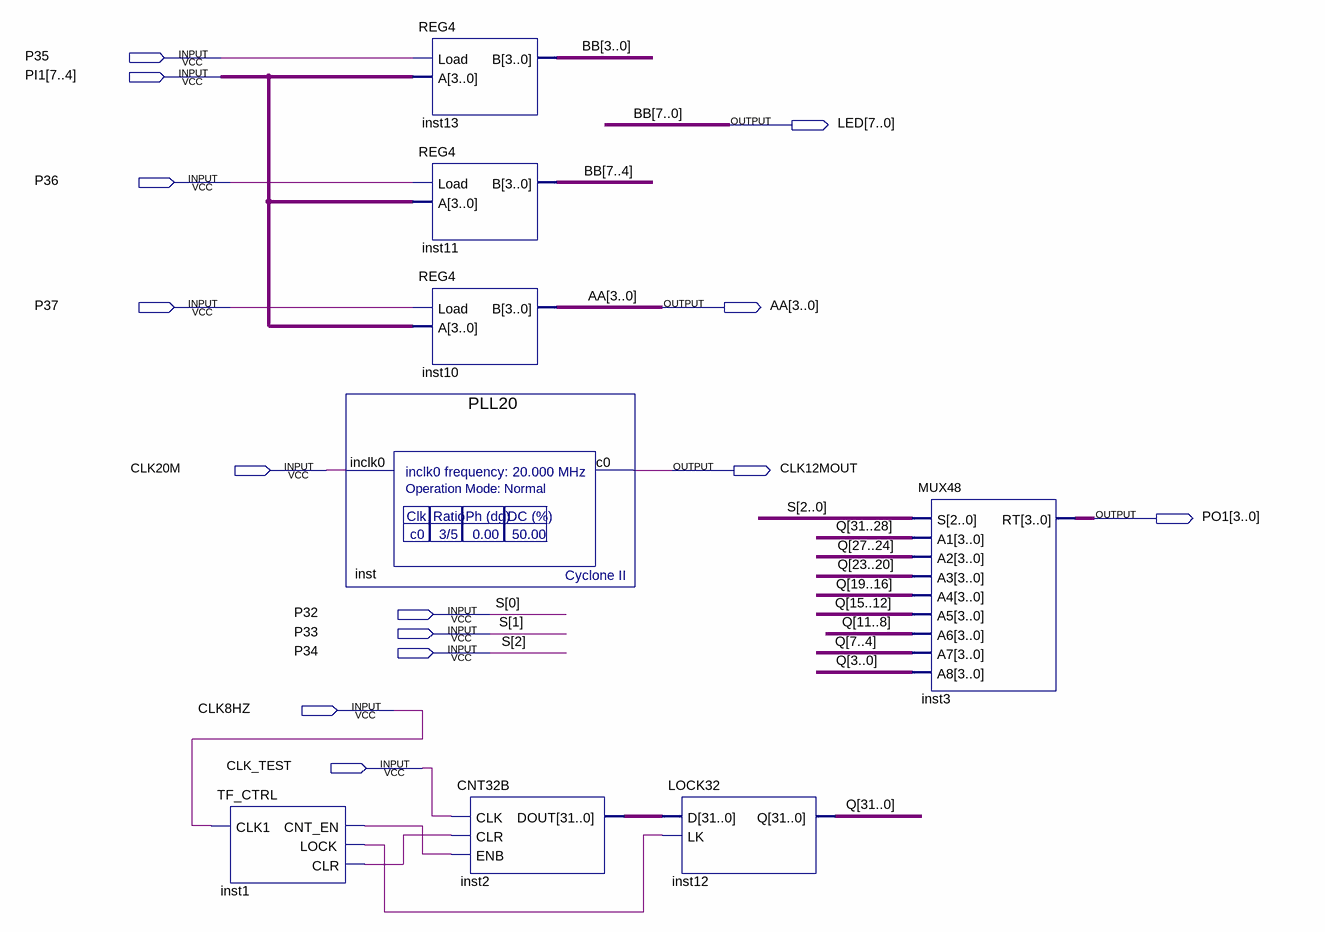
[diagram p0: schematic sheet]
// Quartus schematic CNT6B.bdf as structural Verilog: 8 symbols, 14 pins
module CNT6B (
  input  P35,
  input  [7:4] PI1,
  input  P36,
  input  P37,
  input  CLK20M,
  input  P32,
  input  P33,
  input  P34,
  input  CLK8HZ,
  input  CLK_TEST,
  output [7:0] LED,
  output [3:0] AA,
  output CLK12MOUT,
  output [3:0] PO1
);

  wire inst1_clr, inst1_cnt_en, inst1_lock;
  wire [31:0] inst2_dout, Q;

  TF_CTRL inst1 (.CLK1(CLK8HZ), .CNT_EN(inst1_cnt_en), .LOCK(inst1_lock), .CLR(inst1_clr));
  PLL20 inst (.inclk0(CLK20M), .c0(CLK12MOUT));
  REG4 inst13 (.Load(P35), .A(PI1), .B(LED[3:0]));
  REG4 inst11 (.Load(P36), .A(PI1), .B(LED[7:4]));
  REG4 inst10 (.Load(P37), .A(PI1), .B(AA));
  CNT32B inst2 (.CLK(CLK_TEST), .CLR(inst1_clr), .ENB(inst1_cnt_en), .DOUT(inst2_dout));
  LOCK32 inst12 (.D(inst2_dout), .LK(inst1_lock), .Q(Q));
  MUX48 inst3 (
    .S({P34, P33, P32}), .A1(Q[31:28]), .A2(Q[27:24]), .A3(Q[23:20]), .A4(Q[19:16]), .A5(Q[15:12]),
    .A6(Q[11:8]), .A7(Q[7:4]), .A8(Q[3:0]), .RT(PO1));

  // Other names for the same wires on the sheet: BB[7:0] = LED; S[2:0] = {P34, P33, P32}
endmodule
